# EAGLE design main (EAGLE 7.4.0)
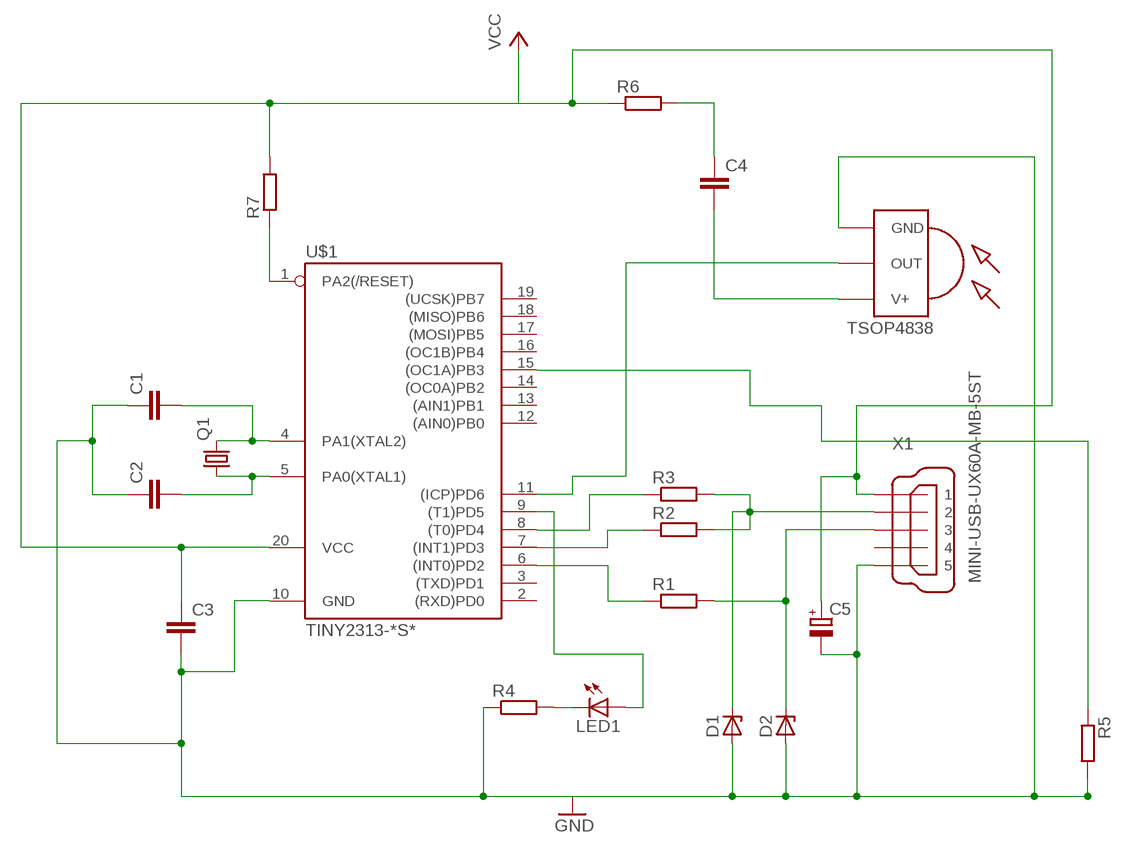
[diagram p0: schematic, sheet 1]

## Parts
C1  C-EUC0603  [C0603]
C2  C-EUC0603  [C0603]
C3  C-EUC0603  [C0603]
C4  C-EUC0603  [C0603]
C5  CPOL-EUE2.5-6  [E2,5-6]
D1  ZENER-DIODESOD80C  [SOD80C]
D2  ZENER-DIODESOD80C  [SOD80C]
LED1  LED3MM  [LED3MM]
Q1  CRYSTALHC49U70  [HC49U70]
R1  R-EU_R0603  [R0603]
R2  R-EU_R0603  [R0603]
R3  R-EU_R0603  [R0603]
R4  R-EU_R0603  [R0603]
R5  R-EU_R0603  [R0603]
R6  R-EU_R0603  [R0603]
R7  R-EU_R0603  [R0603]
U$1  TINY2313-*S*  [SO20L$]
U$2  TSOP4838  [TSOP18XX]
X1  MINI-USB-UX60A-MB-5ST  [UX60A-MB-5ST]

## Nets
GND: C1.1 C2.1 C3.2 C5.- D1.A D2.A R4.1 R5.2 U$1.10(GND) U$2.GND X1.5
N$1: C1.2 Q1.2 U$1.4(PA1(XTAL2))
N$2: C2.2 Q1.1 U$1.5(PA0(XTAL1))
N$3: R7.1 U$1.1(PA2(/RESET))
N$5: C3.1 C5.+ R6.1 R7.2 U$1.20(VCC) X1.1
N$6: LED1.K(C) R4.2
N$7: R5.1 U$1.15((OC1A)PB3)
N$8: LED1.A U$1.9((T1)PD5)
N$9: R3.1 U$1.8((T0)PD4)
N$10: R2.1 U$1.7((INT1)PD3)
N$11: R1.1 U$1.6((INT0)PD2)
N$13: C4.2 U$2.VCC(V+)
N$15: U$1.11((ICP)PD6) U$2.OUT
N$16: D1.C R2.2 R3.2 X1.2
N$18: D2.C R1.2 X1.3
N$19: C4.1 R6.2
Unconnected: U$1.2((RXD)PD0) U$1.3((TXD)PD1) U$1.12((AIN0)PB0) U$1.13((AIN1)PB1) U$1.14((OC0A)PB2) U$1.16((OC1B)PB4) U$1.17((MOSI)PB5) U$1.18((MISO)PB6) U$1.19((UCSK)PB7) X1.4

## Library data of the parts
C1-C4 = resistor:C-EU: CAPACITOR, European symbol
C5 = rcl:CPOL-EU: POLARIZED CAPACITOR, European symbol
D1 D2 = diode:ZENER-DIODE: Z-Diode
LED1 = led:LED: LED OSRAM: - CHIPLED LG R971, LG N971, LY N971, LG Q971, LY Q971, LO R971, LY R971 LH N974, LH R974 LS Q976, LO Q976, LY Q976 LO Q996 - Hyper CHIPLED LW Q18S LB Q993, LB Q99A, LB R99A - SideLED LS A670, LO A670, LY A670, LG A670, LP A670 LB A673, LV A673, LT A673, LW A673 LH A674 LY A675 LS A676, LA A676, LO A676, LY A676, LW A676 LS A679, LY A679, LG A679 - Hyper Micro SIDELED® LS Y876, LA Y876, LO Y876, LY Y876 LT Y87S - SmartLED LW L88C, LW L88S LB L89C, LB L89S, LG L890 LS L89K, LO L89K, LY L89K LS L896, LA L896, LO L896, LY L896 - TOPLED LS T670, LO T670, LY T670, LG T670, LP T670 LSG T670, LSP T670, LSY T670, LOP T670, LYG T670 LG T671, LOG T671, LSG T671 LB T673, LV T673, LT T673, LW T673 LH T674 LS T676, LA T676, LO T676, LY T676, LB T676, LH T676, LSB T676, LW T676 LB T67C, LV T67C, LT T67C, LS T67K, LO T67K, LY T67K, LW E67C LS E67B, LA E67B, LO E67B, LY E67B, LB E67C, LV E67C, LT E67C LW T67C LS T679, LY T679, LG T679 LS T770, LO T770, LY T770, LG T770, LP T770 LB T773, LV T773, LT T773, LW T773 LH T774 LS E675, LA E675, LY E675, LS T675 LS T776, LA T776, LO T776, LY T776, LB T776 LHGB T686 LT T68C, LB T68C - Hyper Mini TOPLED® LB M676 - Mini TOPLED Santana® LG M470 LS M47K, LO M47K, LY M47K Source: http://www.osram.convergy.de LUXEON: - LUMILED® LXK2-PW12-R00, LXK2-PW12-S00, LXK2-PW14-U00, LXK2-PW14-V00 LXK2-PM12-R00, LXK2-PM12-S00, LXK2-PM14-U00 LXK2-PE12-Q00, LXK2-PE12-R00, LXK2-PE12-S00, LXK2-PE14-T00, LXK2-PE14-U00 LXK2-PB12-K00, LXK2-PB12-L00, LXK2-PB12-M00, LXK2-PB14-N00, LXK2-PB14-P00, LXK2-PB14-Q00 LXK2-PR12-L00, LXK2-PR12-M00, LXK2-PR14-Q00, LXK2-PR14-R00 LXK2-PD12-Q00, LXK2-PD12-R00, LXK2-PD12-S00 LXK2-PH12-R00, LXK2-PH12-S00 LXK2-PL12-P00, LXK2-PL12-Q00, LXK2-PL12-R00 Source: www.luxeon.com KINGBRIGHT: KA-3528ASYC Source: www.kingbright.com
Q1 = crystal:CRYSTAL: CRYSTAL; OC_FARNELL: unknown; OC_NEWARK: unknown
R1-R7 = resistor:R-EU_: RESISTOR, European symbol
U$1 = avr-6:TINY2313*: Atmel Tiny2313 2K Flash, 128 bytes EEPROM, 128 bytes RAM
U$2 = tsop-1:TSOP4838: IR Receiver and Demodulator
X1 = con-hirose:MINI-USB-: MINI USB Connector Source: http://www.hirose.co.jp/cataloge_hp/e24000019.pdf; OC_FARNELL: unknown; OC_NEWARK: unknown

## Board
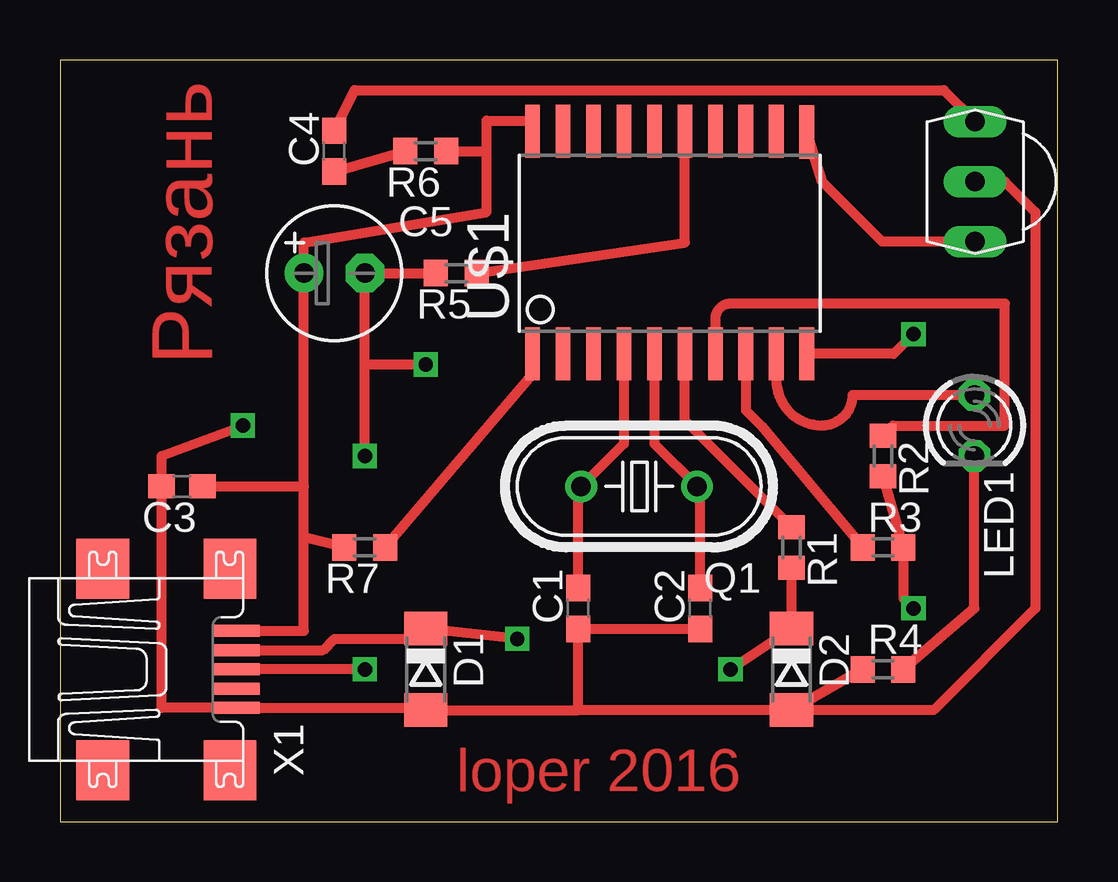
[diagram p1: board, top side]
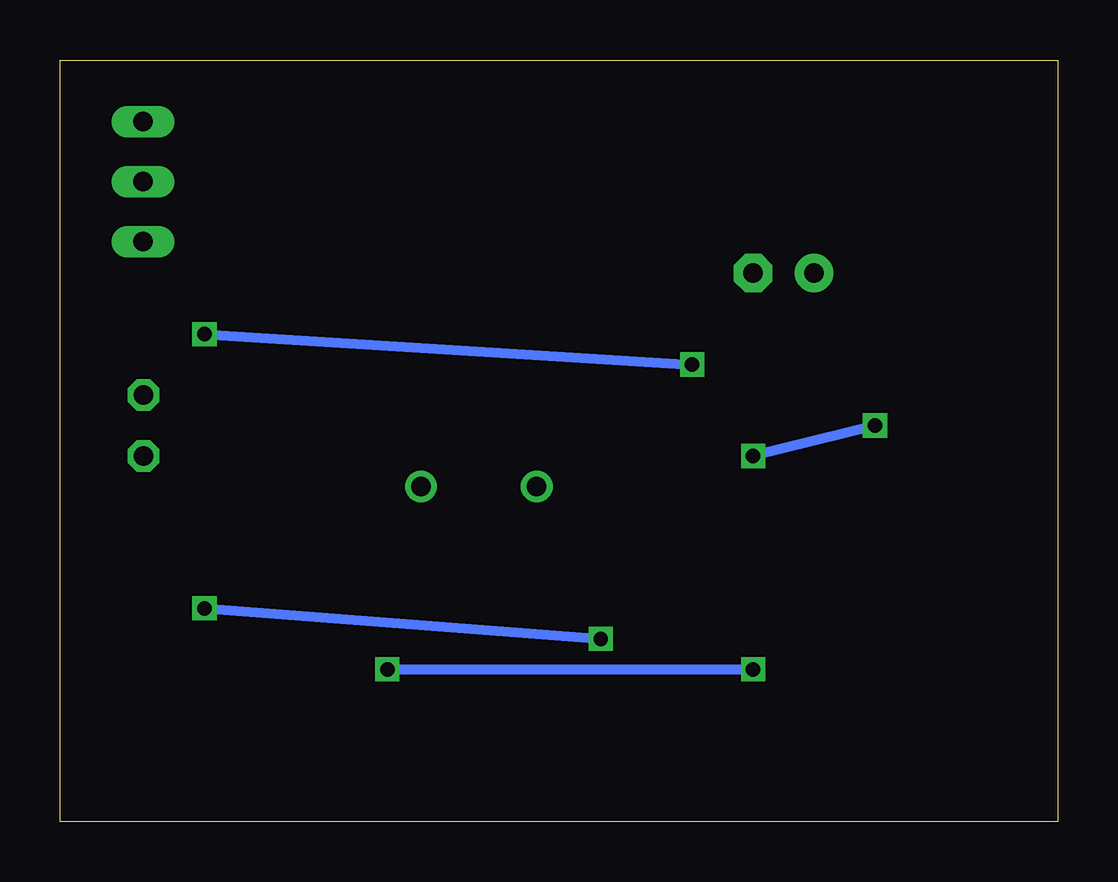
[diagram p2: board, bottom side, seen from below]

Size 41.58 x 31.74 mm. Coordinates in mm from the lower left corner, seen from the top.
Outline: 0,0 41.58,0 41.58,31.74 0,31.74 0,0
Copper layers (1*16): Top 0.035mm / dielectric 1.5mm / Bottom 0.035mm
Design rules "default": minimum track width 10mil, minimum drill 24mil, track to track 8mil, track to pad 8mil, pad to pad 8mil, via to via 8mil, smd to smd 8mil, copper to edge 40mil, drill to drill 8mil, minimum pad ring 10mil, minimum via ring 8mil, stop-mask expansion 4mil, vias tented up to drill 0mil, thermal gap 10mil

### Footprints (pad centres in the part's own frame; a part is rotated, then mirrored left to right if it is on the bottom)
C0603 = smd 1.1 x 1: 1 -0.85,0; 2 0.85,0
E2,5-6 = drill 0.813 pad 1.6: + -1.27,0 | drill 0.813 pad 1.6 octagon: - 1.27,0
SOD80C = smd 1.4 x 1.8: A 1.7,0; C -1.7,0
LED3MM = drill 0.813 octagon: A -1.27,0; K 1.27,0
HC49U70 = drill 0.813: 1 -2.413,0; 2 2.413,0
R0603 = smd 1 x 1.1: 1 -0.85,0; 2 0.85,0
SO20L$ = smd 0.61 x 2.21: 1 -5.715,-4.636; 2 -4.445,-4.636; 3 -3.175,-4.636; 4 -1.905,-4.636; 5 -0.635,-4.636; 6 0.635,-4.636; 7 1.905,-4.636; 8 3.175,-4.636; 9 4.445,-4.636; 10 5.715,-4.636; 11 5.715,4.61; 12 4.445,4.636; 13 3.175,4.636; 14 1.905,4.636; 15 0.635,4.636; 16 -0.635,4.636; 17 -1.905,4.636; 18 -3.175,4.636; 19 -4.445,4.636; 20 -5.715,4.636
TSOP18XX = drill 0.813 long: GND -0.001,-0.027; OUT -2.501,-0.027; VCC 2.499,-0.027
UX60A-MB-5ST = smd 2 x 0.5: 1 2.25,1.6; 2 2.25,0.8; 3 2.25,0; 4 2.25,-0.8; 5 2.25,-1.6 | smd 2.2 x 2.5: M1 -3.3,-4.2; M2 -3.3,4.2; M3 2,4.2; M4 2,-4.2

### Placement (x,y rotation side)
C1  21.59,8.89 90 top
C2  26.67,8.89 90 top
C3  5.08,13.97 180 top
C4  11.43,27.94 90 top
C5  11.43,22.86 0 top
D1  15.24,6.35 270 top
D2  30.48,6.35 270 top
LED1  38.1,16.51 270 top
Q1  24.13,13.97 180 top
R1  30.48,11.43 270 top
R2  34.29,15.24 270 top
R3  34.29,11.43 0 top
R4  34.29,6.35 0 top
R5  16.51,22.86 180 top
R6  15.24,27.94 180 top
R7  12.7,11.43 180 top
U$1  25.4,24.13 0 top
U$2  38.1,26.67 90 top
X1  5.08,6.35 0 top

### Tracks (layer width: path | path; a pad name or v marks a point on that pad's centre or on a via)
GND  (via drill 0.6)
  Top 0.406: C2.1 C1.1 21.59,4.65 | 21.59,4.65 D1.A 15.14,4.75 X1.5 4.23,4.75 C3.2 4.23,15.24 v7.62,16.51 | R5.2 C5.- 12.7,19.05 | D2.A 21.59,4.65 | R4.1 D2.A | v35.56,20.32 34.73,19.5 U$1.10 | v12.7,15.24 12.7,19.05 | v15.24,19.05 12.7,19.05 | U$2.GND 39.37,26.67 40.64,25.4 40.64,8.89 36.4,4.65 D2.A
  Bottom 0.406: v7.62,16.51 v12.7,15.24 | v35.56,20.32 v15.24,19.05
N$1
  Top 0.406: U$1.4 23.5,15.75 Q1.2 21.59,13.84 C1.2
N$2
  Top 0.406: U$1.5 24.77,15.75 Q1.1 26.67,13.84 C2.2
N$3
  Top 0.406: R7.1 19.68,18.63 U$1.1
N$5
  Top 0.406: X1.1 10.16,7.95 10.16,11.85 | 10.16,11.85 10.16,13.97 | 10.16,13.97 C5.+ 10.16,24.13 17.78,25.4 17.78,27.94 | R7.2 10.16,11.85 | C3.1 10.16,13.97 | 17.78,27.94 17.78,29.21 19.68,29.21 U$1.20 | R6.1 17.78,27.94
N$6
  Top 0.406: R4.2 38.1,8.89 LED1.K
N$7
  Top 0.406: R5.1 26.04,24.13 U$1.15
N$8
  Top 0.406: LED1.A 33.02,17.78 arc-90 31.75,16.51 arc-90 29.84,18.41 U$1.9
N$9
  Top 0.406: U$1.8 28.57,17.14 29.21,16.51 R3.1
N$10
  Top 0.406: U$1.7 27.3,20.96 arc-90 27.94,21.59 39.37,21.59 39.37,16.51 34.71,16.51 R2.1
N$11
  Top 0.406: R1.1 26.04,16.73 U$1.6
N$13
  Top 0.406: C4.2 12.28,30.48 36.83,30.48 38.13,29.18 U$2.VCC
N$15
  Top 0.406: U$2.OUT 34.25,24.17 31.75,26.67 U$1.11
N$16  (via drill 0.6)
  Top 0.406: R2.2 R3.2 35.14,9.31 v35.56,8.89 | X1.2 10.96,7.15 11.43,7.62 14.81,7.62 D1.C v19.05,7.62
  Bottom 0.406: v35.56,8.89 v19.05,7.62
N$18  (via drill 0.6)
  Top 0.406: R1.2 D2.C v27.94,6.35 | v12.7,6.35 X1.3
  Bottom 0.406: v27.94,6.35 v12.7,6.35
N$19
  Top 0.406: C4.1 R6.2

### Text on the board
Top: Рязань | loper 2016